# Altium schematic sheet Reference_Design.SchDoc
size A3; SheetNumber: 3; SheetTotal: 3
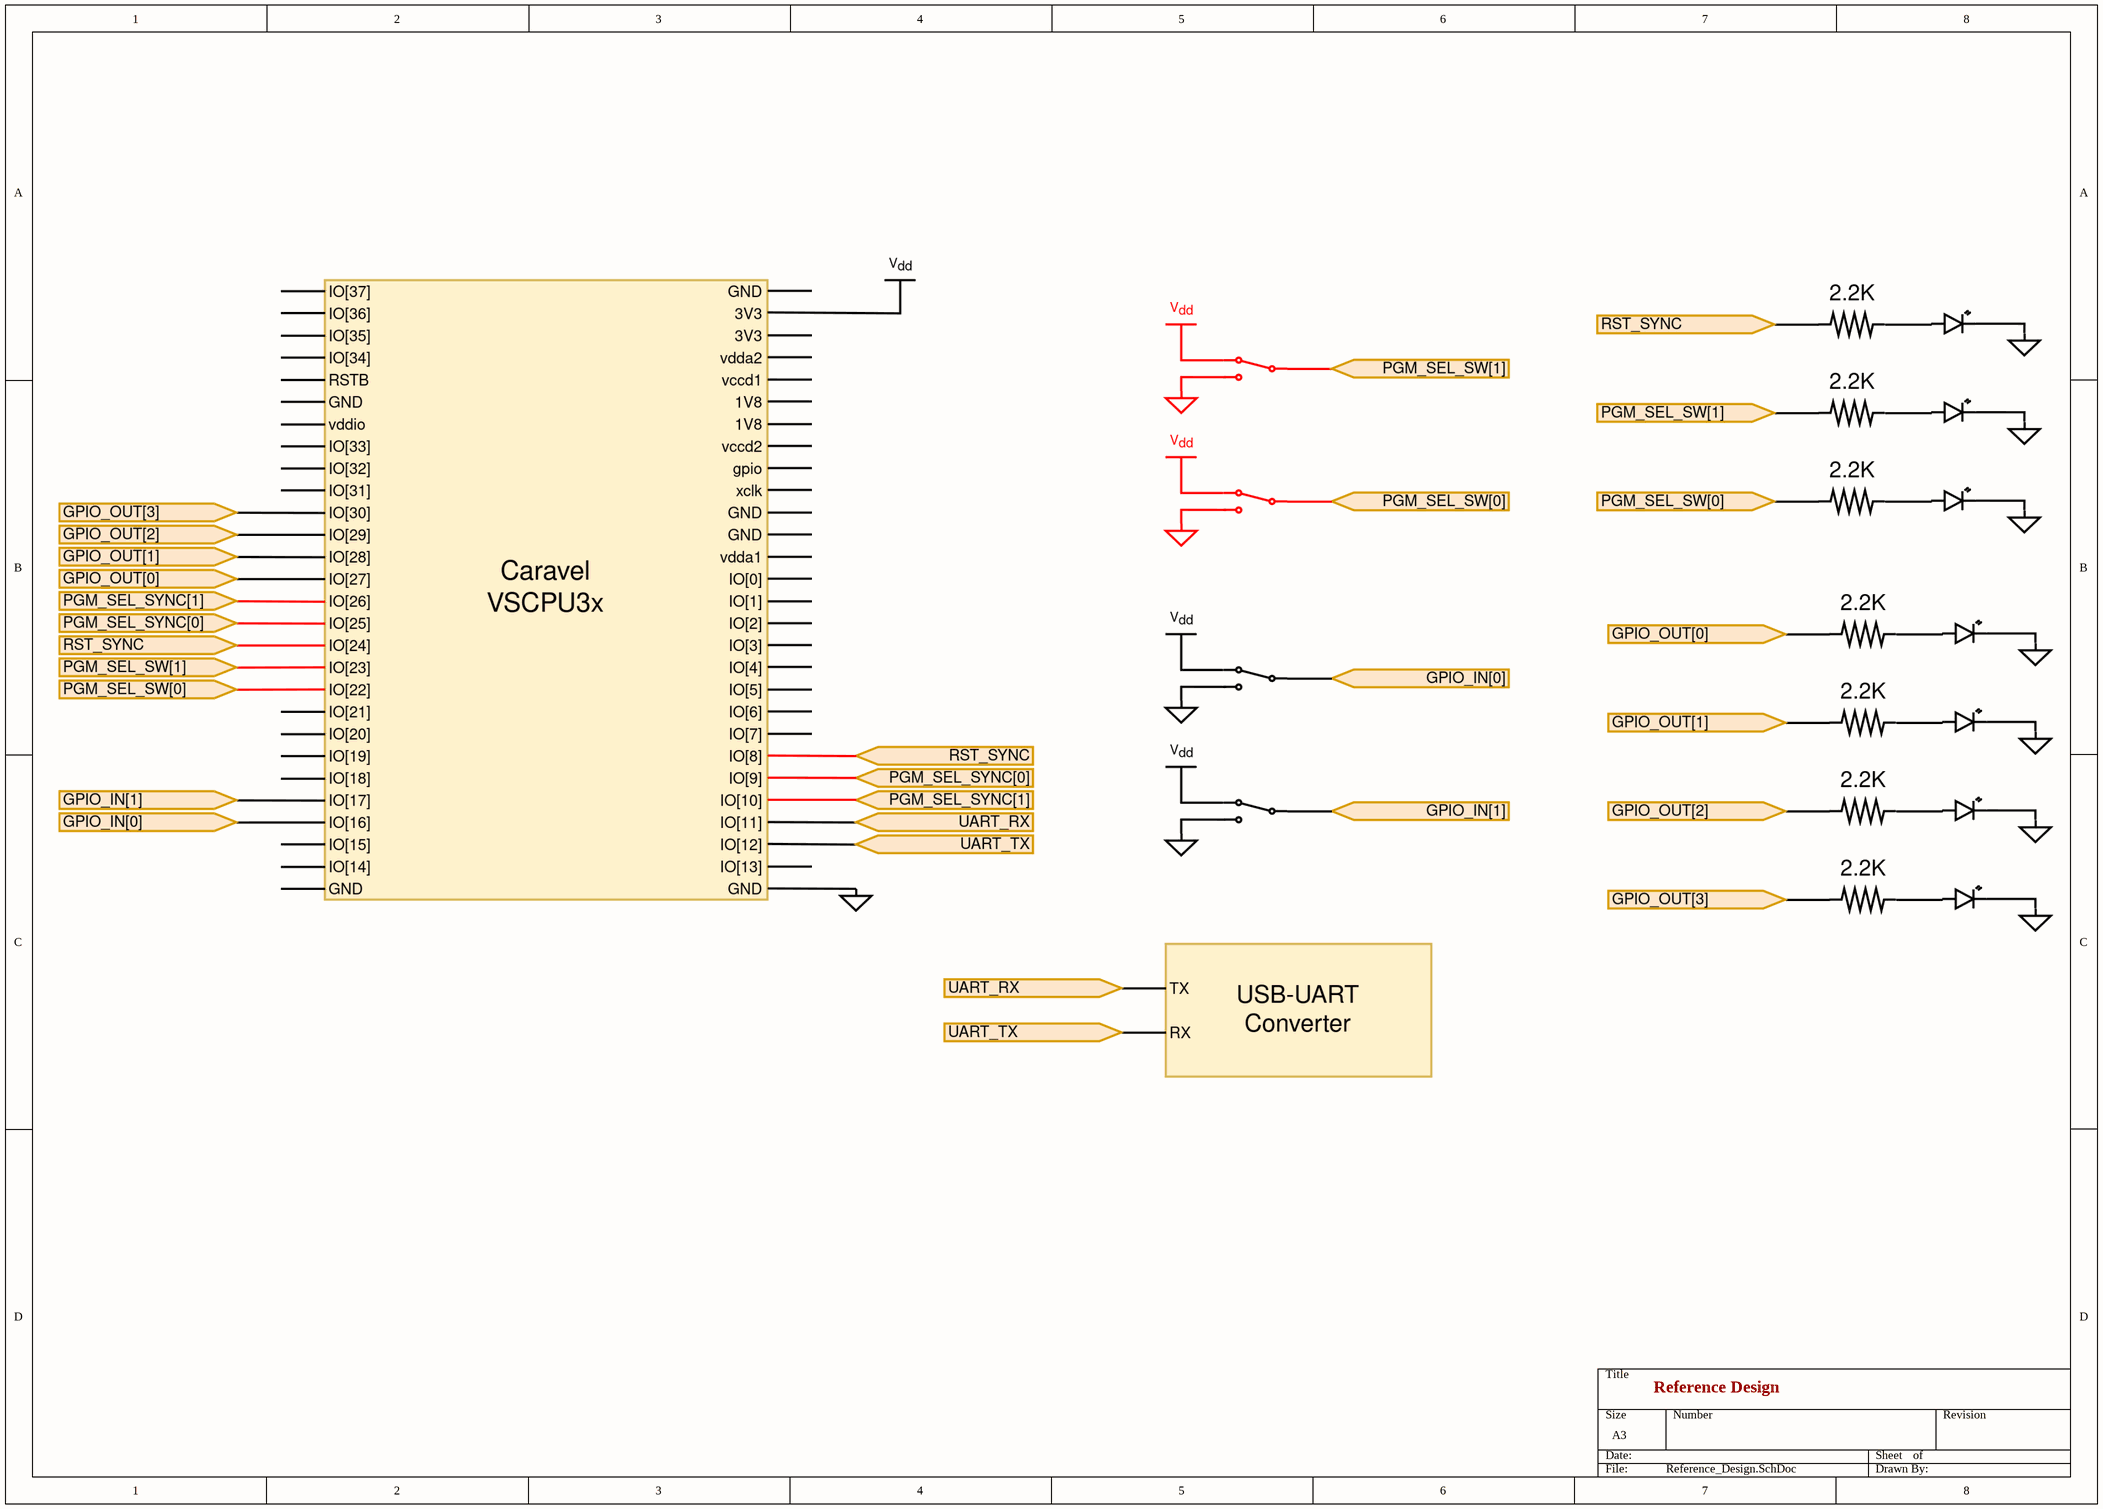
[diagram p0: Reference_Design.SchDoc]

## Notes on the sheet
- Reference Design